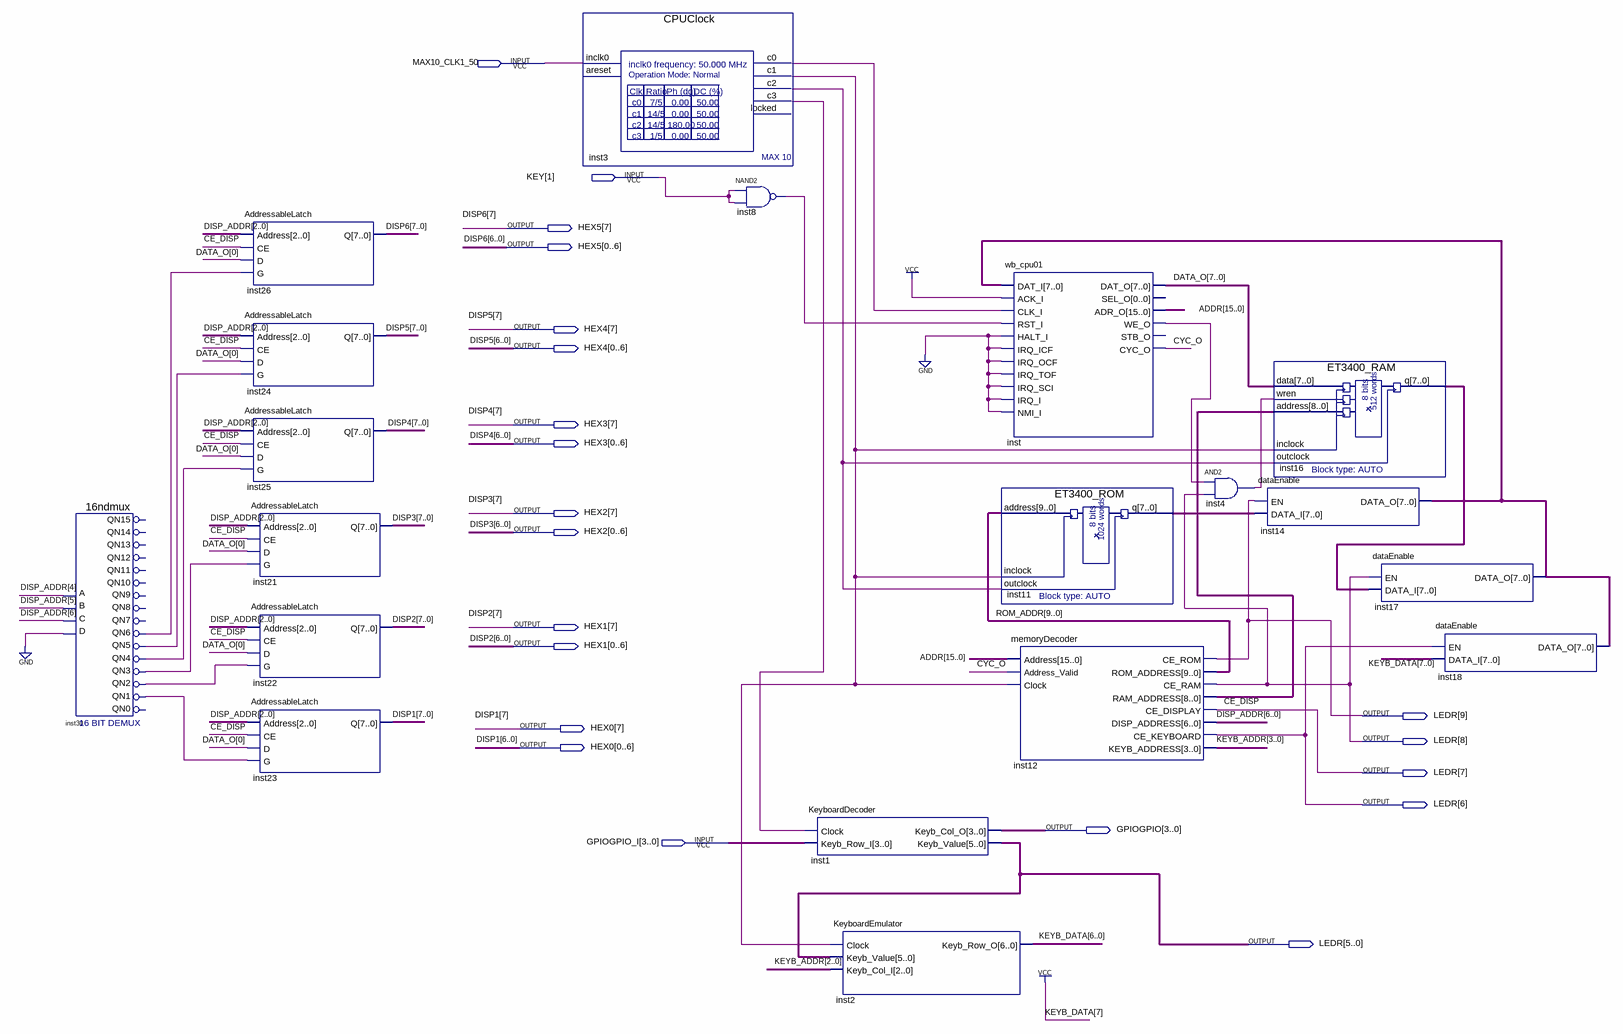
[diagram p0: schematic sheet]
// Quartus schematic Main.bdf as structural Verilog: 19 symbols, 21 pins
module Main (
  input  MAX10_CLK1_50,
  input  [1:1] KEY,
  input  [3:0] GPIOGPIO_I,
  output [0:7] HEX5,
  output [0:7] HEX4,
  output [0:7] HEX3,
  output [0:7] HEX2,
  output [0:7] HEX1,
  output [9:0] LEDR,
  output [0:7] HEX0,
  output [3:0] GPIOGPIO
);

  wire CYC_O, inst3_c0, inst3_c1, inst3_c2, inst3_c3, inst4_out, inst8_out, inst30_qn1, inst30_qn2,
       inst30_qn3, inst30_qn4, inst30_qn5, inst30_qn6, inst_we_o;
  wire [3:0] KEYB_ADDR;
  wire [6:0] DISP_ADDR, KEYB_DATA;
  wire [7:0] DATA_O, inst11_q, inst14_data_o, inst16_q;
  wire [8:0] inst12_ram_address;
  wire [9:0] ROM_ADDR;
  wire [15:0] ADDR;

  \16ndmux  inst30 (
    .A(DISP_ADDR[4]), .C(DISP_ADDR[6]), .B(DISP_ADDR[5]), .D(1'b0), .QN3(inst30_qn3), .QN6(inst30_qn6),
    .QN5(inst30_qn5), .QN4(inst30_qn4), .QN2(inst30_qn2), .QN1(inst30_qn1));  // open: QN15, QN12, QN13, QN14, QN7, QN10, QN11, QN9, QN8, QN0
  AddressableLatch inst26 (
    .Address(DISP_ADDR[2:0]), .CE(LEDR[7]), .D(DATA_O[0]), .G(inst30_qn6), .Q({HEX5[7], HEX5[0:6]}));
  AddressableLatch inst24 (
    .Address(DISP_ADDR[2:0]), .CE(LEDR[7]), .D(DATA_O[0]), .G(inst30_qn5), .Q({HEX4[7], HEX4[0:6]}));
  AddressableLatch inst25 (
    .Address(DISP_ADDR[2:0]), .CE(LEDR[7]), .D(DATA_O[0]), .G(inst30_qn4), .Q({HEX3[7], HEX3[0:6]}));
  AddressableLatch inst21 (
    .Address(DISP_ADDR[2:0]), .CE(LEDR[7]), .D(DATA_O[0]), .G(inst30_qn3), .Q({HEX2[7], HEX2[0:6]}));
  AddressableLatch inst22 (
    .Address(DISP_ADDR[2:0]), .CE(LEDR[7]), .D(DATA_O[0]), .G(inst30_qn2), .Q({HEX1[7], HEX1[0:6]}));
  AddressableLatch inst23 (
    .Address(DISP_ADDR[2:0]), .CE(LEDR[7]), .D(DATA_O[0]), .G(inst30_qn1), .Q({HEX0[7], HEX0[0:6]}));
  CPUClock inst3 (
    .inclk0(MAX10_CLK1_50), .c0(inst3_c0), .c1(inst3_c1), .c2(inst3_c2), .c3(inst3_c3));  // open: areset, locked
  nand inst8 (inst8_out, KEY[1], KEY[1]);
  KeyboardDecoder inst1 (.Clock(inst3_c3), .Keyb_Row_I(GPIOGPIO_I), .Keyb_Col_O(GPIOGPIO), .Keyb_Value(LEDR[5:0]));
  KeyboardEmulator inst2 (
    .Clock(inst3_c1), .Keyb_Value(LEDR[5:0]), .Keyb_Col_I(KEYB_ADDR[2:0]), .Keyb_Row_O(KEYB_DATA));
  wb_cpu01 inst (
    .DAT_I(inst14_data_o), .ACK_I(1'b1), .CLK_I(inst3_c0), .RST_I(inst8_out), .HALT_I(1'b0), .IRQ_ICF(1'b0),
    .IRQ_OCF(1'b0), .IRQ_TOF(1'b0), .IRQ_SCI(1'b0), .IRQ_I(1'b0), .NMI_I(1'b0), .DAT_O(DATA_O), .ADR_O(ADDR),
    .WE_O(inst_we_o), .CYC_O(CYC_O));  // open: SEL_O, STB_O
  ET3400_ROM inst11 (.address(ROM_ADDR), .inclock(inst3_c1), .outclock(inst3_c2), .q(inst11_q));
  memoryDecoder inst12 (
    .Address(ADDR), .Address_Valid(CYC_O), .Clock(inst3_c1), .CE_ROM(LEDR[9]), .ROM_ADDRESS(ROM_ADDR),
    .CE_RAM(LEDR[8]), .RAM_ADDRESS(inst12_ram_address), .CE_DISPLAY(LEDR[7]), .DISP_ADDRESS(DISP_ADDR),
    .CE_KEYBOARD(LEDR[6]), .KEYB_ADDRESS(KEYB_ADDR));
  and inst4 (inst4_out, inst_we_o, LEDR[8]);
  ET3400_RAM inst16 (
    .data(DATA_O), .wren(inst4_out), .address(inst12_ram_address), .inclock(inst3_c1), .outclock(inst3_c2),
    .q(inst16_q));
  dataEnable inst14 (.EN(LEDR[9]), .DATA_I(inst11_q), .DATA_O(inst14_data_o));
  dataEnable inst17 (.EN(LEDR[8]), .DATA_I(inst16_q), .DATA_O(inst14_data_o));
  dataEnable inst18 (.EN(LEDR[6]), .DATA_I({1'b1, KEYB_DATA}), .DATA_O(inst14_data_o));

  // Other names for the same wires on the sheet: DISP1[7:0] = {HEX0[7], HEX0[0:6]}; DISP2[7:0] = {HEX1[7], HEX1[0:6]};
  //   DISP3[7:0] = {HEX2[7], HEX2[0:6]}; DISP4[7:0] = {HEX3[7], HEX3[0:6]}; DISP5[7:0] = {HEX4[7], HEX4[0:6]};
  //   DISP6[7:0] = {HEX5[7], HEX5[0:6]}; CE_DISP = LEDR[7]
endmodule
